# EAGLE design TestRig (EAGLE 6.4)
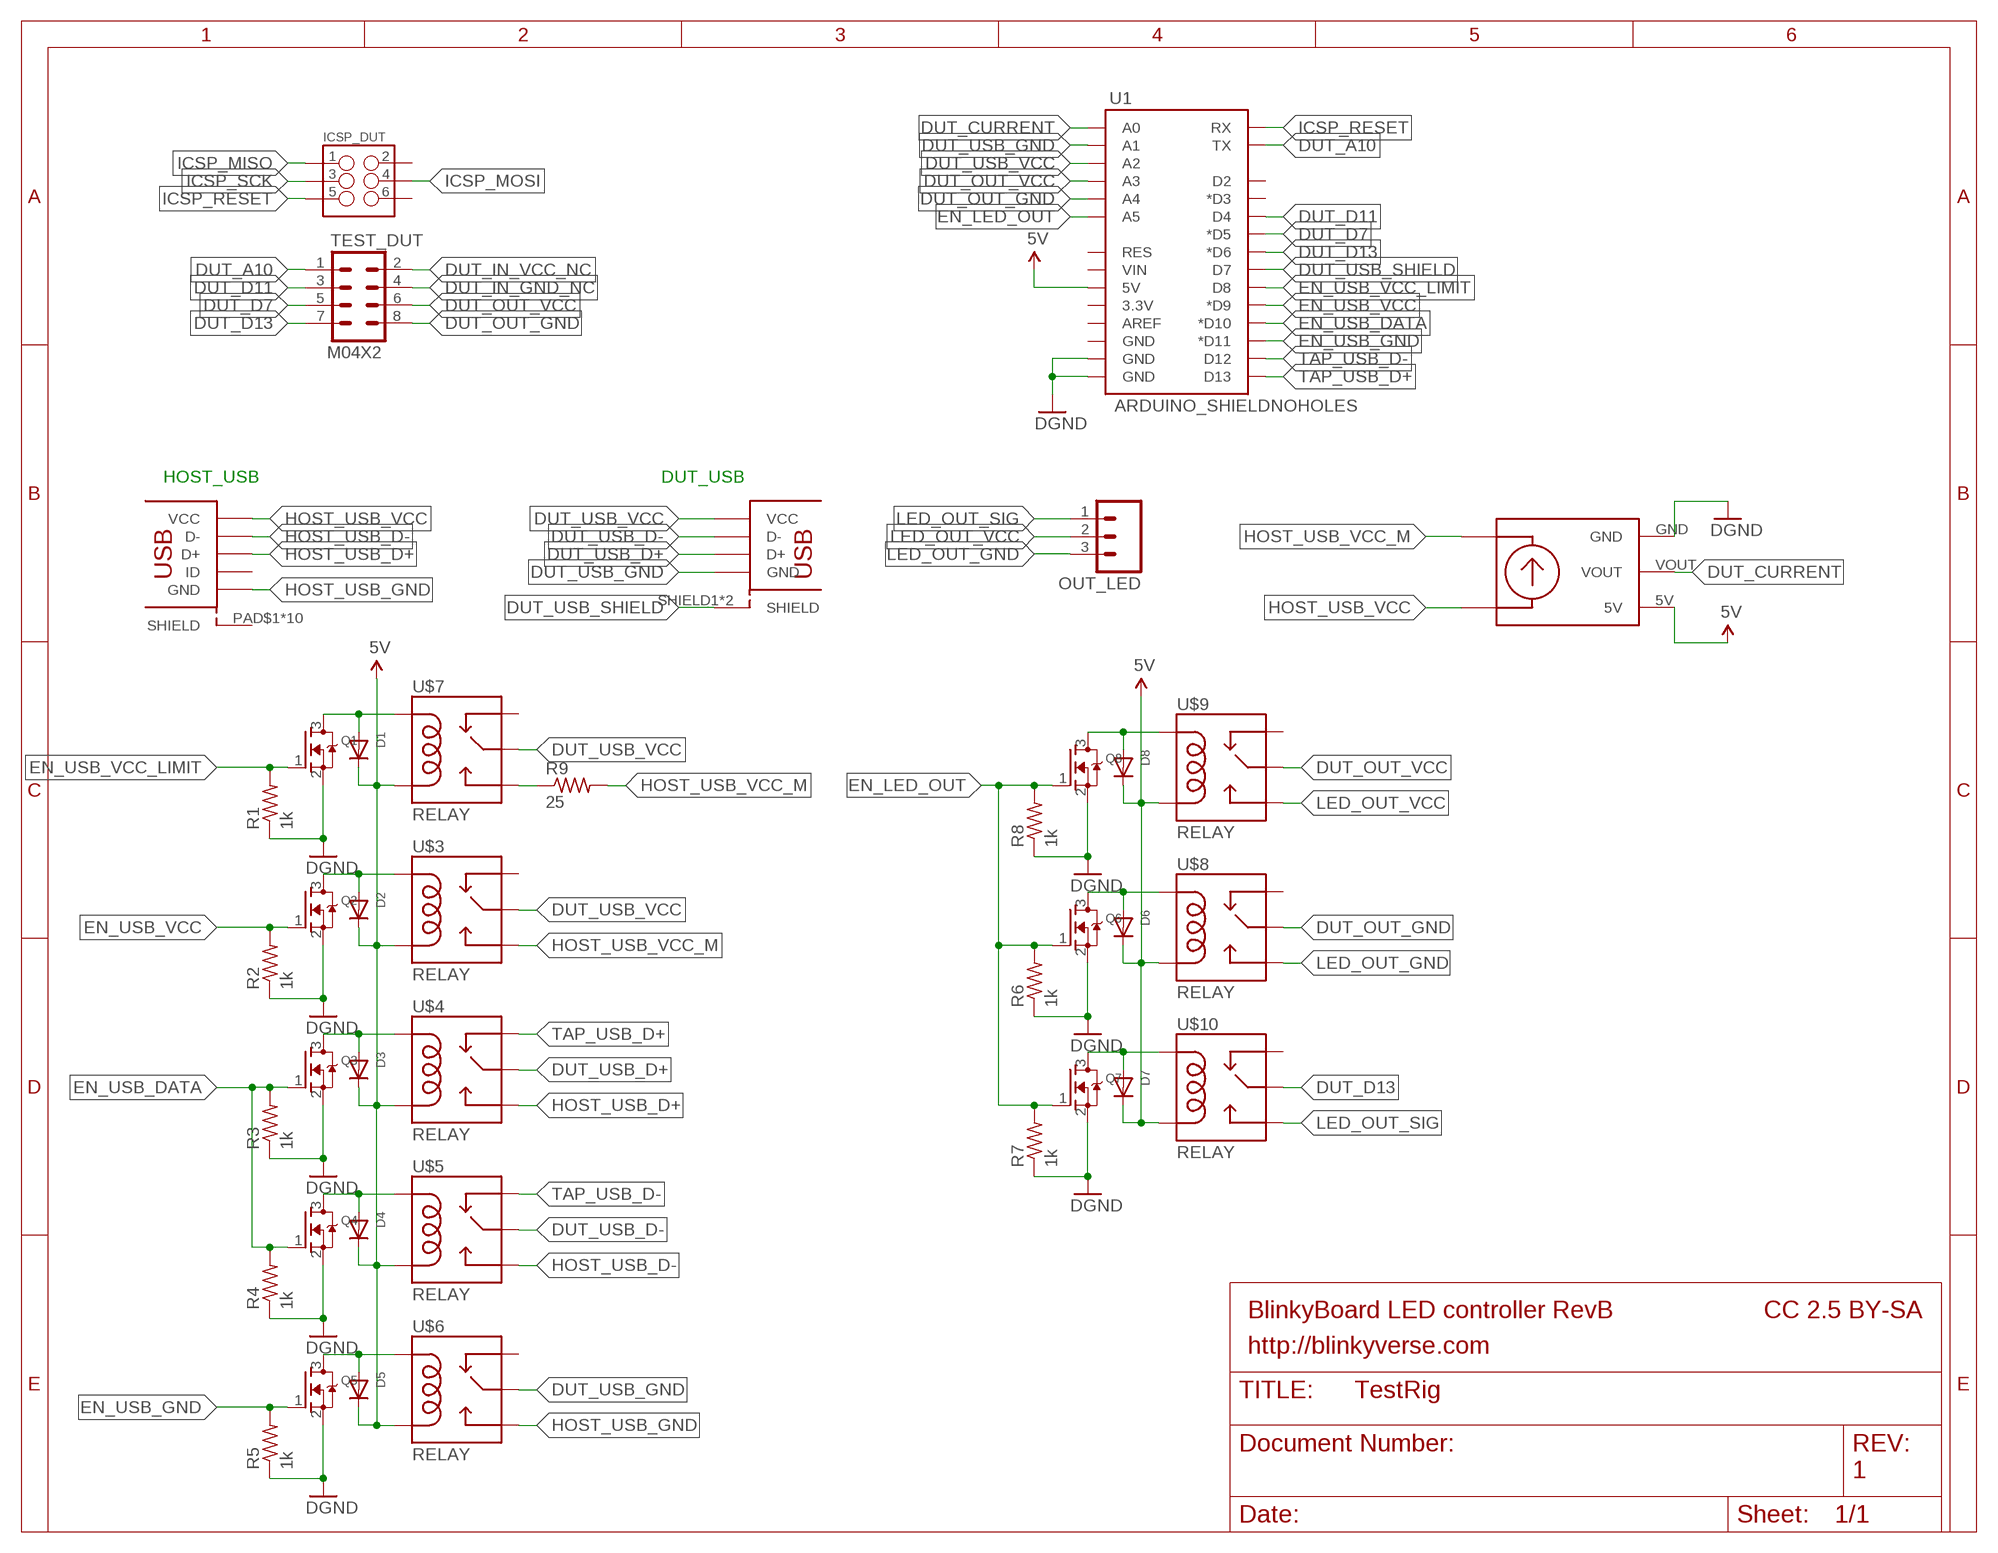
[diagram p0: schematic, sheet 1]

## Parts
D1  DIODESOD-523  [SOD-523]
D2  DIODESOD-523  [SOD-523]
D3  DIODESOD-523  [SOD-523]
D4  DIODESOD-523  [SOD-523]
D5  DIODESOD-523  [SOD-523]
D6  DIODESOD-523  [SOD-523]
D7  DIODESOD-523  [SOD-523]
D8  DIODESOD-523  [SOD-523]
ICSP_DUT  M03X2NO_SILK  [2X3-NS]
OUT_LED  M03PTH  [1X03]
Q1  MOSFET-NREFLOW  [SOT23]
Q2  MOSFET-NREFLOW  [SOT23]
Q3  MOSFET-NREFLOW  [SOT23]
Q4  MOSFET-NREFLOW  [SOT23]
Q5  MOSFET-NREFLOW  [SOT23]
Q6  MOSFET-NREFLOW  [SOT23]
Q7  MOSFET-NREFLOW  [SOT23]
Q8  MOSFET-NREFLOW  [SOT23]
R1  1k  R-US_R0603  [R0603]
R2  1k  R-US_R0603  [R0603]
R3  1k  R-US_R0603  [R0603]
R4  1k  R-US_R0603  [R0603]
R5  1k  R-US_R0603  [R0603]
R6  1k  R-US_R0603  [R0603]
R7  1k  R-US_R0603  [R0603]
R8  1k  R-US_R0603  [R0603]
R9  25  R-US_R1210  [R1210]
TEST_DUT  M04X2  [2X4]
U1  ARDUINO_SHIELDNOHOLES  [DUEMILANOVE_SHIELD_NOHOLES]
U$1  USB  [USB_A_FEMALE_NOSILK_SHIELD]
U$2  MICRO_USBSMT+THRUHULE  [MICRO_USB_FCI_THRUHOLE]
U$3  RELAY  [RELAY_HK23F-5V]
U$4  RELAY  [RELAY_HK23F-5V]
U$5  RELAY  [RELAY_HK23F-5V]
U$6  RELAY  [RELAY_HK23F-5V]
U$7  RELAY  [RELAY_HK23F-5V]
U$8  RELAY  [RELAY_HK23F-5V]
U$9  RELAY  [RELAY_HK23F-5V]
U$10  RELAY  [RELAY_HK23F-5V]
U$11  SPARKFUN_ACS712  [SPARKFUN_ACS712]

## Nets
5V: D1.K(C) D2.K(C) D3.K(C) D4.K(C) D5.K(C) D6.K(C) D7.K(C) D8.K(C) U1.5V U$3.P$5(COIL2) U$4.P$5(COIL2) U$5.P$5(COIL2) U$6.P$5(COIL2) U$7.P$5(COIL2) U$8.P$5(COIL2) U$9.P$5(COIL2) U$10.P$5(COIL2) U$11.5V
DUT_A10: TEST_DUT.1 U1.TX
DUT_CURRENT: U1.A0 U$11.VOUT
DUT_D7: TEST_DUT.5 U1.D5(*D5)
DUT_D11: TEST_DUT.3 U1.D4
DUT_D13: TEST_DUT.7 U1.D6(*D6) U$10.P$1(MAIN) U$10.P$6(MAIN)
DUT_IN_GND_NC: TEST_DUT.4
DUT_IN_VCC_NC: TEST_DUT.2
DUT_OUT_GND: TEST_DUT.8 U1.A4 U$8.P$1(MAIN) U$8.P$6(MAIN)
DUT_OUT_VCC: TEST_DUT.6 U1.A3 U$9.P$1(MAIN) U$9.P$6(MAIN)
DUT_USB_D+: U$1.D+ U$4.P$1(MAIN) U$4.P$6(MAIN)
DUT_USB_D-: U$1.D- U$5.P$1(MAIN) U$5.P$6(MAIN)
DUT_USB_GND: U1.A1 U$1.GND U$6.P$1(MAIN) U$6.P$6(MAIN)
DUT_USB_SHIELD: U1.D7 U$1.SHIELD1(SHIELD) U$1.SHIELD2(SHIELD)
DUT_USB_VCC: U1.A2 U$1.VBUS(VCC) U$3.P$1(MAIN) U$3.P$6(MAIN) U$7.P$1(MAIN) U$7.P$6(MAIN)
EN_LED_OUT: Q6.1(G) Q7.1(G) Q8.1(G) R6.2 R7.2 R8.2 U1.A5
EN_USB_DATA: Q3.1(G) Q4.1(G) R3.2 R4.2 U1.D10(*D10)
EN_USB_GND: Q5.1(G) R5.2 U1.D11(*D11)
EN_USB_VCC: Q2.1(G) R2.2 U1.D9(*D9)
EN_USB_VCC_LIMIT: Q1.1(G) R1.2 U1.D8
GND: Q1.2(S) Q2.2(S) Q3.2(S) Q4.2(S) Q5.2(S) Q6.2(S) Q7.2(S) Q8.2(S) R1.1 R2.1 R3.1 R4.1 R5.1 R6.1 R7.1 R8.1 U1.GND@0(GND) U1.GND@1(GND) U$11.GND ; supply symbol labelled DGND
HOST_USB_D+: U$2.PIN$3(D+) U$4.P$3(NO)
HOST_USB_D-: U$2.PIN$2(D-) U$5.P$3(NO)
HOST_USB_GND: U$2.PIN$5(GND) U$6.P$3(NO)
HOST_USB_VCC: U$2.PIN$1(VCC) U$11.IP-
HOST_USB_VCC_M: R9.2 U$3.P$3(NO) U$11.IP+
ICSP_MISO: ICSP_DUT.1
ICSP_MOSI: ICSP_DUT.4
ICSP_RESET: ICSP_DUT.5 U1.RX
ICSP_SCK: ICSP_DUT.3
LED_OUT_GND: OUT_LED.3 U$8.P$3(NO)
LED_OUT_SIG: OUT_LED.1 U$10.P$3(NO)
LED_OUT_VCC: OUT_LED.2 U$9.P$3(NO)
N$9: R9.1 U$7.P$3(NO)
N$14: D1.A Q1.3(D) U$7.P$2(COIL1)
N$20: D2.A Q2.3(D) U$3.P$2(COIL1)
N$27: D3.A Q3.3(D) U$4.P$2(COIL1)
N$31: D4.A Q4.3(D) U$5.P$2(COIL1)
N$35: D5.A Q5.3(D) U$6.P$2(COIL1)
N$38: D6.A Q6.3(D) U$8.P$2(COIL1)
N$42: D7.A Q7.3(D) U$10.P$2(COIL1)
N$46: D8.A Q8.3(D) U$9.P$2(COIL1)
TAP_USB_D+: U1.D13 U$4.P$4(NC)
TAP_USB_D-: U1.D12 U$5.P$4(NC)
Unconnected: ICSP_DUT.2 ICSP_DUT.6 U1.3.3V U1.AREF U1.D2 U1.D3(*D3) U1.GND@2(GND) U1.RES U1.VIN U$2.PAD$1(SHIELD) U$2.PAD$2(SHIELD) U$2.PAD$3(SHIELD) U$2.PAD$4(SHIELD) U$2.PAD$5(SHIELD) U$2.PAD$6(SHIELD) U$2.PAD$7(SHIELD) U$2.PAD$8(SHIELD) U$2.PAD$9(SHIELD) U$2.PAD$10(SHIELD) U$2.PIN$4(ID) U$3.P$4(NC) U$6.P$4(NC) U$7.P$4(NC) U$8.P$4(NC) U$9.P$4(NC) U$10.P$4(NC)

## Notes on the sheet
- HOST_USB | DUT_USB
- BlinkyBoard LED controller RevB | CC 2.5 BY-SA
- http://blinkyverse.com
- 1

## Library data of the parts
D1-D8 = adafruit:DIODE: Diode SMADIODE - SMA Surface Mount Package 20V 1A Schottky Diode Digikey: 641-1014-6-ND DO-1N4148 - Through Hole Small Current Diode SOD-123 20V 1 A (.5mV Vf) Schottky Diode - Digikey: MBRX120TPMSCT-ND SOD-323 10V 570mA (.38mV Vf, 3ns) Schottky Diode - Digikey: ZLLS410CT-ND SOD-523 30V 30mA Schottky Diode (RB751S-40TE61) - Digikey: RB751S-40TE61CT-ND SOT23-R/W - SOT23 Package (R = Solder Paste/Reflow Ovens, W = Hand-Soldering) BAT54Film 40V 300mA - Digikey: 497-7162-1-ND
ICSP_DUT = SparkFun-Connectors:M03X2: 2x3 .1" header. Shrouded, with keying- CONN-10681 SMT- CONN-11415 Pogo pins- HW-11044
OUT_LED = SparkFun-Connectors:M03: Header 3 Standard 3-pin 0.1" header. Use with straight break away headers (SKU : PRT-00116), right angle break away headers (PRT-00553), swiss pins (PRT-00743), machine pins (PRT-00117), and female headers (PRT-00115). Molex polarized connector foot print use with SKU : PRT-08232 with associated crimp pins and housings.
Q1-Q8 = adafruit:MOSFET-N: N-Channel Mosfet 2N7002E - 60V 260mA SOT23 [Digikey: 2N7002ET1GOSTR-ND] - REEL BSH103 - 30V 850mA SOT23 [Digikey: 568-5013-1-ND]
R1-R9 = adafruit:R-US_: RESISTOR, American symbol
TEST_DUT = SparkFun-Connectors:M04X2: .1" header, two rows of four.
U1 = SparkFun-Boards:ARDUINO_SHIELD: Arduino shield footprint
U$1 = blinkiverse:USB
U$2 = blinkiverse:MICRO_USB
U$3-U$10 = blinkiverse:RELAY
U$11 = blinkiverse:SPARKFUN_ACS712

## Board
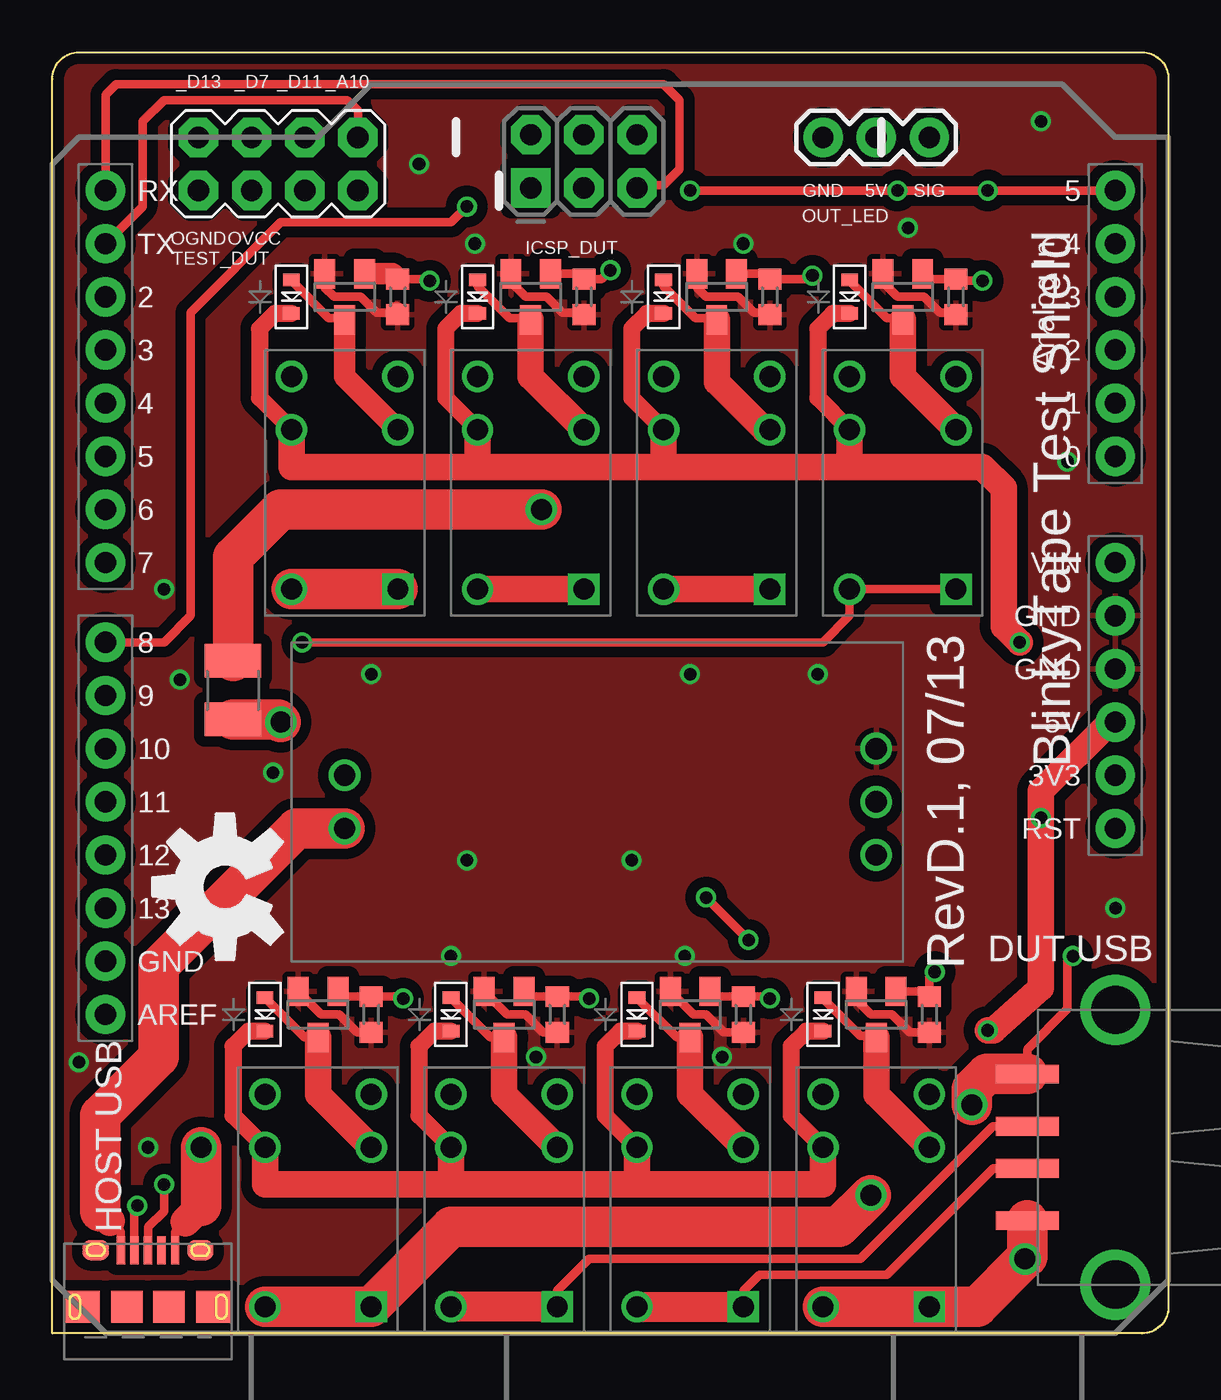
[diagram p1: board, top side]
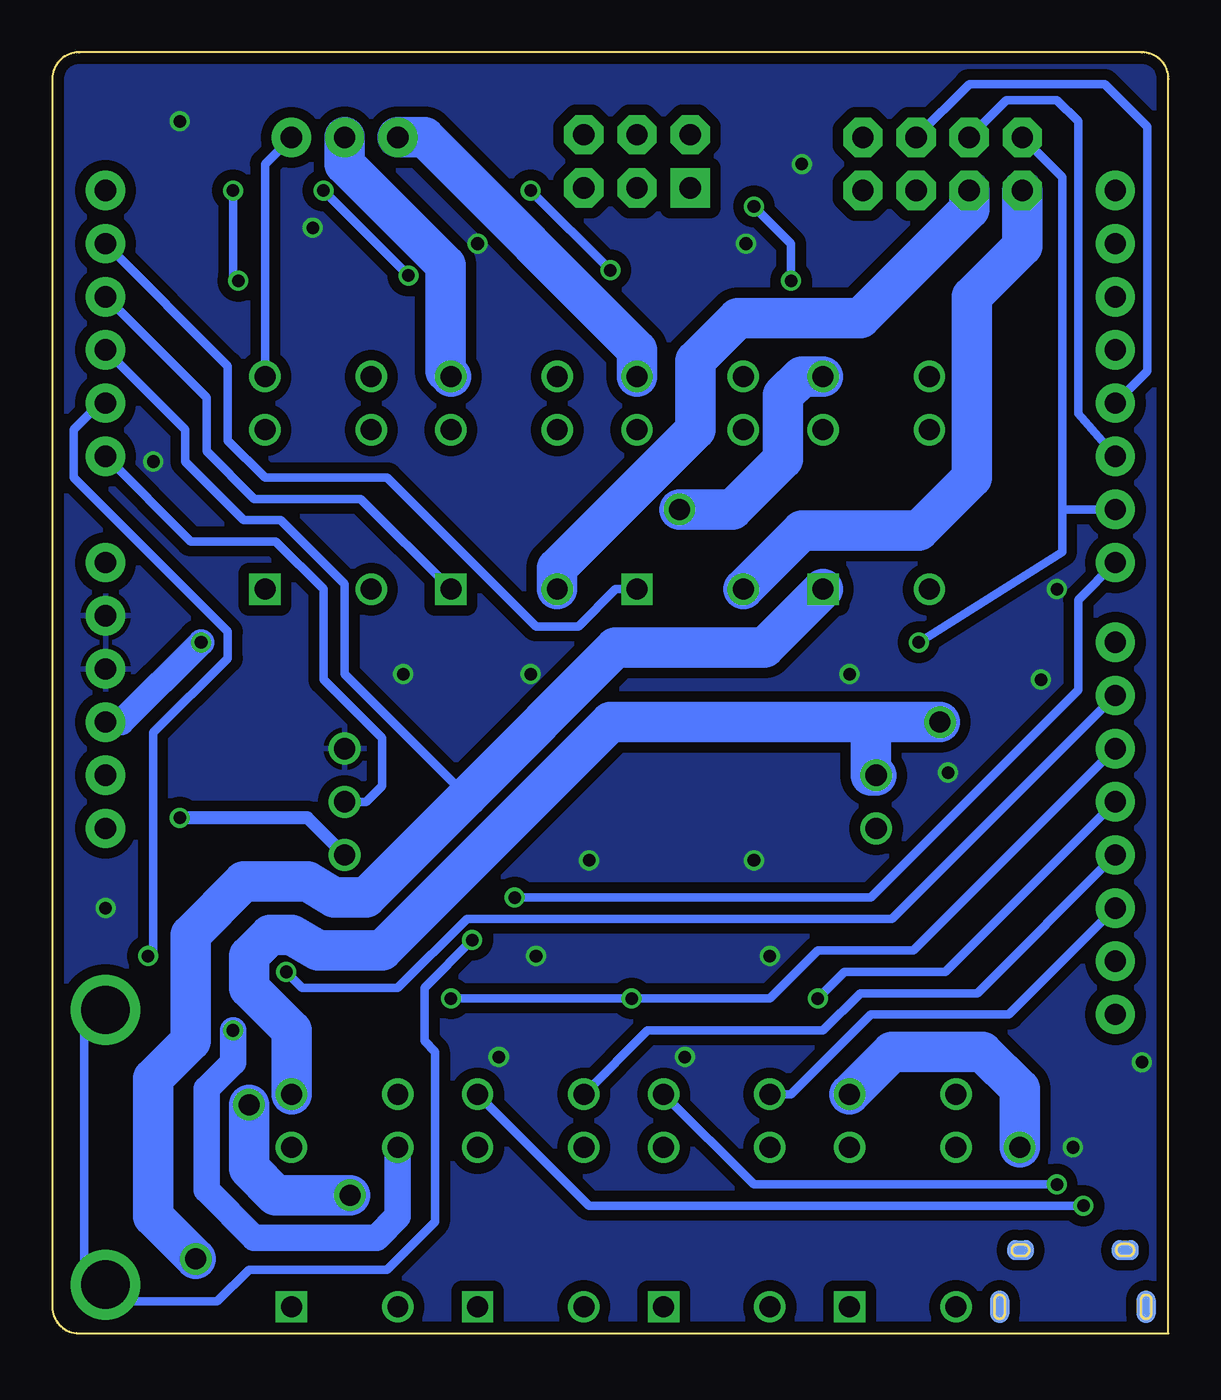
[diagram p2: board, bottom side, seen from below]

Size 53.34 x 61.21 mm. Coordinates in mm from the lower left corner, seen from the top.
Outline: 0,0 0,59.94 arc-90 1.27,61.21 52.07,61.21 arc-90 53.34,59.94 53.34,1.27 arc-90 52.07,0 0,0
Copper layers (1*16): Top 0.0356mm / dielectric 1.5011mm / Bottom 0.0356mm
Design rules "LaenPCBOrder *": minimum track width 6mil, minimum drill 13mil, track to track 6mil, track to pad 6mil, pad to pad 6mil, via to via 6mil, smd to smd 6mil, copper to edge 15mil, drill to drill 6mil, minimum pad ring 7mil, minimum via ring 7mil, stop-mask expansion 4mil, vias tented up to drill 0.35mm, thermal gap 10mil

### Footprints (pad centres in the part's own frame; a part is rotated, then mirrored left to right if it is on the bottom)
SOD-523 = smd 0.8 x 0.6: A 0,-0.8; K 0,0.8
2X3-NS = drill 1.016 pad 1.88 square: 1 -2.54,-1.27 | drill 1.016 pad 1.88 octagon: 2 -2.54,1.27; 3 0,-1.27; 4 0,1.27; 5 2.54,-1.27; 6 2.54,1.27
1X03 = drill 1.016 pad 1.88: 1 0,0; 2 2.54,0; 3 5.08,0
SOT23 = smd 1 x 1.4: 1 -0.95,-1.1; 2 0.95,-1.1; 3 0,1.1
R0603 = smd 1 x 1.1: 1 -0.85,0; 2 0.85,0
R1210 = smd 1.6 x 2.7: 1 -1.4,0; 2 1.4,0
2X4 = drill 1.016 pad 1.88 octagon: 1 -3.81,-1.27; 2 -3.81,1.27; 3 -1.27,-1.27; 4 -1.27,1.27; 5 1.27,-1.27; 6 1.27,1.27; 7 3.81,-1.27; 8 3.81,1.27
DUEMILANOVE_SHIELD_NOHOLES = drill 1.016 pad 1.88: 3.3V 50.8,26.67; 5V 50.8,29.21; A0 50.8,41.91; A1 50.8,44.45; A2 50.8,46.99; A3 50.8,49.53; A4 50.8,52.07; A5 50.8,54.61; AREF 2.54,15.24; D2 2.54,49.53; D3 2.54,46.99; D4 2.54,44.45; D5 2.54,41.91; D6 2.54,39.37; D7 2.54,36.83; D8 2.54,33.02; D9 2.54,30.48; D10 2.54,27.94; D11 2.54,25.4; D12 2.54,22.86; D13 2.54,20.32; GND@0 50.8,31.75; GND@1 50.8,34.29; GND@2 2.54,17.78; RES 50.8,24.13; RX 2.54,54.61; TX 2.54,52.07; VIN 50.8,36.83
USB_A_FEMALE_NOSILK_SHIELD = smd 3 x 0.9: D+ 4.212,-1; D- 4.212,1; GND 4.212,-3.5; VBUS 4.212,3.5 | drill 2.311: SHIELD1 0,6.566; SHIELD2 0,-6.566
MICRO_USB_FCI_THRUHOLE = smd 1.645 x 1.55: PAD$1 -3.123,0; PAD$4 3.123,0 | smd 1.5 x 1.55: PAD$2 -1,0; PAD$3 1,0 | smd 1.25 x 0.95: PAD$5 -2.5,2.7; PAD$6 2.5,2.7 | smd 0.9 x 1.55 bottom: PAD$7 -3.5,0; PAD$8 3.5,0 | smd 1.25 x 0.95 bottom: PAD$9 -2.5,2.7; PAD$10 2.5,2.7 | smd 0.4 x 1.35: PIN$1 -1.3,2.7; PIN$2 -0.65,2.7; PIN$3 0,2.7; PIN$4 0.65,2.7; PIN$5 1.3,2.7
RELAY_HK23F-5V = drill 1 square: P$1 5.08,2.54 | drill 1: P$2 -2.54,2.54; P$3 -5.08,2.54; P$4 -5.08,-2.54; P$5 -2.54,-2.54; P$6 5.08,-2.54
SPARKFUN_ACS712 = drill 1.016: 5V 13.97,-2.54; GND 13.97,2.54; IP+ -11.43,1.27; IP- -11.43,-1.27; VOUT 13.97,0

### Placement (x,y rotation side)
D1  11.43,49.53 180 top
D2  36.83,15.24 180 top
D3  19.05,15.24 180 top
D4  27.94,15.24 180 top
D5  10.16,15.24 180 top
D6  20.32,49.53 180 top
D7  38.1,49.53 180 top
D8  29.21,49.53 180 top
ICSP_DUT  25.4,56.01 0 top
OUT_LED  41.91,57.15 180 top
Q1  13.97,49.53 180 top
Q2  39.37,15.24 180 top
Q3  21.59,15.24 180 top
Q4  30.48,15.24 180 top
Q5  12.7,15.24 180 top
Q6  22.86,49.53 180 top
Q7  40.64,49.53 180 top
Q8  31.75,49.53 180 top
R1  16.51,49.53 90 top
R2  41.91,15.24 90 top
R3  24.13,15.24 90 top
R4  33.02,15.24 90 top
R5  15.24,15.24 90 top
R6  25.4,49.53 90 top
R7  43.18,49.53 90 top
R8  34.29,49.53 90 top
R9  8.64,30.73 270 top
TEST_DUT  10.79,55.88 180 top
U1  0,0 0 top
U$1  50.8,8.89 180 top
U$2  4.57,1.27 0 top
U$3  39.37,6.35 270 top
U$4  21.59,6.35 270 top
U$5  30.48,6.35 270 top
U$6  12.7,6.35 270 top
U$7  13.97,40.64 270 top
U$8  22.86,40.64 270 top
U$9  31.75,40.64 270 top
U$10  40.64,40.64 270 top
U$11  25.4,25.4 0 top
U$12  [OSHW-LOGO-L]  8.26,21.34 90 top

### Tracks (layer width: path | path; a pad name or v marks a point on that pad's centre or on a via)
5V  (via drill 0.6)
  Top 0.813: D1.K 10.63,48.73 9.91,48.01 9.91,44.7 U$7.P$5 | D6.K 19.52,48.73 18.8,48.01 18.8,44.7 U$8.P$5 | D8.K 28.41,48.73 27.69,48.01 27.69,44.7 U$9.P$5 | D7.K 37.3,48.73 36.58,48.01 36.58,44.7 U$10.P$5 | D2.K 36.03,14.44 35.31,13.72 35.31,10.41 U$3.P$5 | D4.K 27.14,14.44 26.42,13.72 26.42,10.41 U$5.P$5 | D3.K 18.25,14.44 17.53,13.72 17.53,10.41 U$4.P$5 | D5.K 9.36,14.44 8.64,13.72 8.64,10.41 U$6.P$5
  Top 1.27: U$3.P$5 36.83,7.11 27.94,7.11 | 19.05,7.11 10.16,7.11 U$6.P$5 | 19.05,7.11 27.94,7.11 | U$5.P$5 27.94,7.11 | U$4.P$5 19.05,7.11 | U$8.P$5 20.32,41.4 | 20.32,41.4 29.21,41.4 | 29.21,41.4 U$9.P$5 | 29.21,41.4 38.1,41.4 | 38.1,41.4 U$10.P$5 | U$7.P$5 11.43,41.4 20.32,41.4 | U1.5V 50.55,29.21 47.24,25.91 v47.24,24.64 47.24,16.51 44.96,14.48 v44.7,14.48 | 38.1,41.4 44.45,41.4 45.47,40.39 45.47,33.78 v46.23,33.02
  Bottom 0.61: U$11.5V 41.15,24.64 v47.24,24.64
  Bottom 1.27: v46.23,33.02 50.04,29.21 U1.5V | U$3.P$5 36.83,5.59 37.85,4.57 43.69,4.57 45.97,6.86 45.97,11.68 44.7,12.95 v44.7,14.48
DUT_A10
  Top 0.406: TEST_DUT.1 14.61,58.42 14.1,58.93 5.33,58.93 4.32,57.91 4.32,53.85 U1.TX
DUT_CURRENT
  Bottom 0.406: U$11.VOUT 38.35,25.4 37.59,26.16 37.59,28.45 40.39,31.24 40.39,35.56 42.67,37.85 46.74,37.85 U1.A0
DUT_D7
  Bottom 0.406: TEST_DUT.5 7.75,58.93 5.33,58.93 4.32,57.91 4.32,43.94 U1.D5
DUT_D11
  Bottom 0.406: U1.D4 1.02,45.97 1.02,57.66 3.05,59.69 9.53,59.69 TEST_DUT.3
DUT_D13  (via drill 0.6)
  Top 0.406: U$10.P$1 U$10.P$6 38.1,34.29 36.83,33.02 v11.94,33.02
  Bottom 0.406: v11.94,33.02 5.08,37.34 5.08,39.37 | 5.08,39.37 5.08,55.24 TEST_DUT.7 | U1.D6 5.08,39.37
DUT_OUT_GND
  Top 1.27: U$8.P$6 U$8.P$1
  Bottom 0.406: U$8.P$1 26.42,35.56 28.19,33.78 30.23,33.78 37.34,40.89 43.18,40.89 44.96,42.67 44.96,46.23 U1.A4
  Bottom 1.93: TEST_DUT.8 6.99,51.94 9.4,49.53 9.4,40.89 11.94,38.35 17.53,38.35 U$8.P$6
DUT_OUT_VCC
  Top 1.27: U$9.P$6 U$9.P$1
  Bottom 0.406: U$9.P$1 38.61,39.88 43.69,39.88 45.97,42.16 45.97,44.7 U1.A3
  Bottom 1.93: TEST_DUT.6 9.53,53.72 14.73,48.51 20.57,48.51 22.61,46.48 22.61,43.18 29.21,36.58 U$9.P$6
DUT_USB_D+
  Top 0.406: U$4.P$1 24.13,2.03 25.65,3.56 38.61,3.56 44.94,9.89 U$1.D+
  Top 1.422: U$4.P$1 U$4.P$6
DUT_USB_D-
  Top 0.406: U$5.P$1 33.02,2.03 33.78,2.79 39.88,2.79 44.97,7.89 U$1.D-
  Top 1.422: U$5.P$6 U$5.P$1
DUT_USB_GND  (via drill 0.6, 1)
  Top 0.406: U$1.GND 46.59,13.57 48.51,15.49 48.51,17.78 v48.77,18.03
  Top 1.93: v39.12,6.6 37.59,5.08 19.05,5.08 U$6.P$1 U$6.P$6 | v43.94,10.92 43.94,11.68 44.65,12.39 U$1.GND
  Bottom 0.406: v48.77,18.03 48.51,18.29 48.51,28.7 44.96,32.26 44.96,33.53 52.32,40.89 52.32,43.18 51.05,44.45 U1.A1
  Bottom 1.93: v39.12,6.6 42.67,6.6 43.94,7.87 v43.94,10.92
DUT_USB_SHIELD  (via drill 0.6)
  Top 0.406: v31.24,20.83 v33.27,18.8
  Bottom 0.406: U1.D7 4.32,35.05 4.32,30.73 14.22,20.83 v31.24,20.83 | v33.27,18.8 35.56,16.51 35.56,13.97 35.05,13.46 35.05,5.33 37.34,3.05 43.94,3.05 45.47,1.52 50,1.52 U$1.SHIELD1 51.82,3.34 51.82,14.44 U$1.SHIELD2
DUT_USB_VCC  (via drill 1)
  Top 1.93: U$3.P$6 U$3.P$1 44.2,1.27 v46.48,3.56 46.59,3.66 U$1.VBUS | U$7.P$6 U$7.P$1
  Bottom 0.406: 33.53,25.65 39.37,31.5 39.37,35.81 42.42,38.86 44.2,38.86 46.99,41.66 46.99,43.18 U1.A2
  Bottom 1.93: U$7.P$1 19.3,32.77 26.42,32.77 33.53,25.65 38.35,20.83 39.88,20.83 41.15,21.59 44.2,21.59 46.74,19.05 46.74,13.97 48.51,12.19 48.51,5.59 v46.48,3.56
EN_LED_OUT  (via drill 0.6)
  Top 0.406: Q7.1 41.84,50.38 R7.2 43.27,50.29 v44.45,50.29 | Q8.1 34.04,50.63 R8.2 36.16,50.38 v36.32,50.55 | Q6.1 25.15,50.63 R6.2 26.25,50.38 v26.67,50.8 | U1.A5 v44.7,54.61 v40.39,54.61 v30.48,54.61
  Bottom 0.406: v44.45,50.29 44.7,50.55 v44.7,54.61 | v36.32,50.55 v40.39,54.61 | v26.67,50.8 v30.48,54.61
EN_USB_DATA  (via drill 0.6)
  Top 0.406: Q3.1 22.79,16.09 R3.2 25.57,16.09 v25.65,16 | Q4.1 31.68,16.09 R4.2 34.2,16.09 v34.29,16
  Bottom 0.406: U1.D10 12.19,18.29 16.76,18.29 19.05,16 v25.65,16 v34.29,16
EN_USB_GND  (via drill 0.6)
  Top 0.406: Q5.1 13.9,16.09 R5.2 16.68,16.09 v16.76,16
  Bottom 0.406: U1.D11 10.67,17.27 15.49,17.27 v16.76,16
EN_USB_VCC  (via drill 0.6)
  Top 0.406: Q2.1 41.66,16.34 R2.2 41.91,17.02 v42.16,17.27
  Bottom 0.406: U1.D9 13.21,19.81 33.53,19.81 36.83,16.51 41.4,16.51 v42.16,17.27
EN_USB_VCC_LIMIT  (via drill 0.6)
  Top 0.406: v19.81,53.85 19.05,53.09 10.92,53.09 6.6,48.77 6.6,34.29 5.33,33.02 U1.D8 | v18.03,50.29 17.95,50.38 R1.2
  Top 1.016: Q1.1 16.26,50.63 R1.2
  Bottom 0.406: v19.81,53.85 18.03,52.07 v18.03,50.29
GND  (via drill 0.6)
  Top 0.406: R2.1 40.98,14.39 40.13,15.24 39.12,15.24 38.42,15.94 Q2.2 | Q3.2 21.74,15.24 22.61,15.24 23.46,14.39 R3.1 | Q5.2 12.85,15.24 13.72,15.24 14.57,14.39 R5.1 | Q4.2 30.63,15.24 31.24,15.24 32.09,14.39 R4.1 | 13.02,49.97 13.46,49.53 14.73,49.53 15.49,48.77 16.42,48.77 | R7.1 43.09,48.77 42.42,48.77 41.66,49.53 40.39,49.53 39.69,50.23 Q7.2 | R8.1 34.2,48.77 33.53,48.77 32.77,49.53 31.24,49.53 30.8,49.97 Q8.2 | R6.1 25.31,48.77 24.38,48.77 23.62,49.53 22.61,49.53 21.91,50.23 Q6.2
  Top 1.016: 16.42,48.77 R1.1
  other vias: 27.69,22.61 15.24,31.5 36.58,31.5 30.23,18.03 19.05,18.03 4.57,8.89 1.27,12.95 30.48,31.5 20.19,52.07 40.89,52.83 47.24,57.91 17.53,55.88 5.33,35.56 50.8,20.32 19.81,22.61 10.54,26.8 6.1,31.24 48.51,41.66 32,13.21 23.11,13.21 33.02,52.07
  pour Top (isolate 0.508): 0,61.21 53.34,61.21 53.34,0 0,0
  pour Bottom (isolate 0.508): 0,0 53.34,0 53.34,61.21 0,61.21
HOST_USB_D+  (via drill 0.6)
  Top 0.406: v5.33,7.11 5.33,5.84 4.57,5.08 U$2.PIN$3
  Bottom 0.406: v5.33,7.11 19.81,7.11 U$4.P$3
HOST_USB_D-  (via drill 0.6)
  Top 0.406: U$2.PIN$2 3.92,5.95 v4.06,6.1
  Bottom 0.406: v4.06,6.1 27.69,6.1 U$5.P$3
HOST_USB_GND  (via drill 1)
  Top 0.406: U$2.PIN$5 5.87,4.86 6.35,5.33
  Top 1.422: 7.11,6.1 6.35,5.33
  Top 1.93: v7.11,8.89 7.11,6.1
  Bottom 1.93: U$6.P$3 13.21,13.46 8.89,13.46 7.11,11.68 v7.11,8.89
HOST_USB_VCC
  Top 0.406: U$2.PIN$1 3.27,4.86 2.76,5.36
  Top 1.422: 2.29,5.84 2.76,5.36
  Top 1.93: 2.29,5.84 2.29,10.41 5.08,13.21 5.08,17.53 11.68,24.13 U$11.IP-
HOST_USB_VCC_M  (via drill 1)
  Top 1.93: R9.2 10.8,29.33 v10.92,29.21
  Bottom 1.93: U$3.P$3 41.91,14.48 43.94,16.51 43.94,18.03 42.93,19.05 41.91,19.05 40.64,18.29 37.59,18.29 26.67,29.21 14.22,29.21 | v10.92,29.21 14.22,29.21 | U$11.IP+ 14.22,26.67 14.22,29.21
ICSP_RESET
  Top 0.406: ICSP_DUT.5 28.07,54.86 29.21,54.86 29.97,55.63 29.97,58.93 29.21,59.69 3.05,59.69 2.54,59.18 U1.RX
LED_OUT_GND
  Bottom 1.93: U$8.P$3 25.4,46.99 35.56,57.15 OUT_LED.3
LED_OUT_SIG
  Bottom 0.406: OUT_LED.1 43.18,55.88 U$10.P$3
LED_OUT_VCC
  Bottom 1.93: U$9.P$3 34.54,45.97 34.54,51.05 39.37,55.88 OUT_LED.2
N$9  (via drill 1)
  Top 1.93: R9.1 8.64,37.08 10.92,39.37 v23.37,39.37
  Bottom 1.93: v23.37,39.37 20.83,39.37 18.41,41.78 18.41,44.83 17.53,45.72 U$7.P$3
N$14
  Top 0.406: D1.A 11.43,50.29 13.21,48.51 13.89,48.51 Q1.3
  Top 1.016: Q1.3 13.97,45.72 U$7.P$2
N$20
  Top 0.406: D2.A 36.83,16 38.61,14.22 39.29,14.22 Q2.3
  Top 1.27: Q2.3 39.37,11.43 U$3.P$2
N$27
  Top 0.406: D3.A 20.95,14.14 Q3.3
  Top 1.27: U$4.P$2 21.59,11.43 Q3.3
N$31
  Top 0.406: D4.A 29.84,14.14 Q4.3
  Top 1.27: U$5.P$2 30.48,11.43 Q4.3
N$35
  Top 0.406: D5.A 12.06,14.14 Q5.3
  Top 1.27: U$6.P$2 12.7,11.43 Q5.3
N$38
  Top 0.406: D6.A 20.32,50.04 21.84,48.51 22.78,48.51 Q6.3
  Top 1.27: Q6.3 22.86,45.72 U$8.P$2
N$42
  Top 0.406: D7.A 38.1,50.29 39.88,48.51 40.56,48.51 Q7.3
  Top 1.27: Q7.3 40.64,45.72 U$10.P$2
N$46
  Top 0.406: D8.A 29.21,50.04 30.73,48.51 31.67,48.51 Q8.3 | U$9.P$2 34.04,43.18
  Top 1.27: 34.04,43.18 31.75,45.47 Q8.3
TAP_USB_D+
  Bottom 0.406: U1.D13 7.62,15.24 14.22,15.24 18.03,11.43 U$4.P$4
TAP_USB_D-
  Bottom 0.406: U1.D12 9.14,16.26 14.73,16.26 16.51,14.48 24.89,14.48 U$5.P$4

### Text on the board
tNames: _D13 | _D7 | _D11 | _A10 | GND | 5V | SIG | OUT_LED | OGND | OVCC | TEST_DUT | BlinkyTape Test Shield | RevD.1, 07/13 | DUT USB | HOST USB